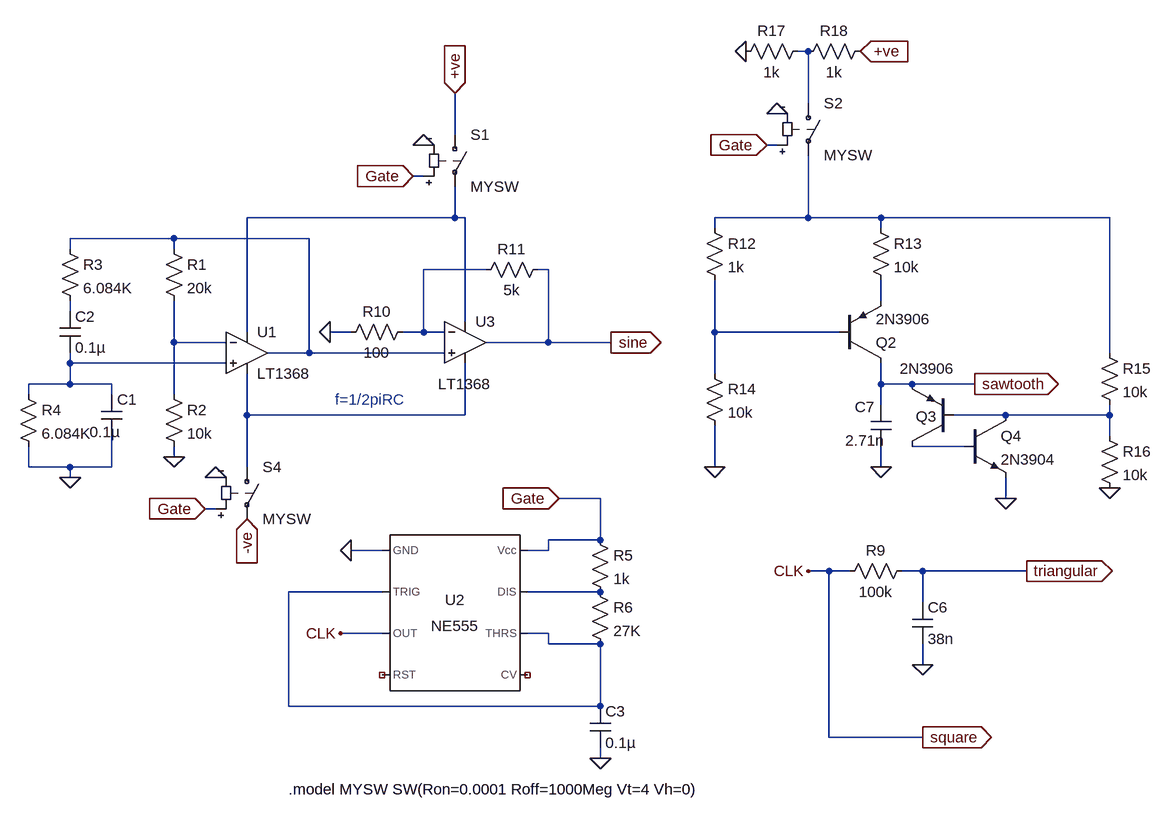
[diagram p0: schematic do.asc]
do.asc, the LTspice schematic file:
Version 4
SHEET 1 2324 792
WIRE -1168 -1440 -1184 -1440
WIRE -1168 -1360 -1168 -1440
WIRE -1712 -1312 -1712 -1376
WIRE -1216 -1296 -1232 -1296
WIRE -1760 -1248 -1776 -1248
WIRE -1712 -1184 -1712 -1232
WIRE -1712 -1184 -2032 -1184
WIRE -1696 -1184 -1712 -1184
WIRE -1168 -1184 -1168 -1280
WIRE -1168 -1184 -1312 -1184
WIRE -1056 -1184 -1168 -1184
WIRE -704 -1184 -1056 -1184
WIRE -1312 -1168 -1312 -1184
WIRE -1056 -1168 -1056 -1184
WIRE -2144 -1152 -2304 -1152
WIRE -1936 -1152 -2144 -1152
WIRE -2304 -1136 -2304 -1152
WIRE -2144 -1136 -2144 -1152
WIRE -1664 -1104 -1760 -1104
WIRE -1568 -1104 -1584 -1104
WIRE -1056 -1056 -1056 -1088
WIRE -2304 -1040 -2304 -1056
WIRE -1696 -1024 -1696 -1184
WIRE -2032 -1008 -2032 -1184
WIRE -1872 -1008 -1904 -1008
WIRE -1760 -1008 -1760 -1104
WIRE -1760 -1008 -1792 -1008
WIRE -1728 -1008 -1760 -1008
WIRE -1312 -1008 -1312 -1088
WIRE -1120 -1008 -1312 -1008
WIRE -2144 -992 -2144 -1056
WIRE -2064 -992 -2144 -992
WIRE -1568 -992 -1568 -1104
WIRE -1568 -992 -1664 -992
WIRE -1472 -992 -1568 -992
WIRE -1936 -976 -1936 -1152
WIRE -1936 -976 -2000 -976
WIRE -1728 -976 -1936 -976
WIRE -704 -976 -704 -1184
WIRE -2304 -960 -2304 -976
WIRE -2064 -960 -2304 -960
WIRE -1312 -944 -1312 -1008
WIRE -2304 -928 -2304 -960
WIRE -2304 -928 -2368 -928
WIRE -2240 -928 -2304 -928
WIRE -1056 -928 -1056 -960
WIRE -1008 -928 -1056 -928
WIRE -912 -928 -1008 -928
WIRE -2368 -912 -2368 -928
WIRE -2240 -912 -2240 -928
WIRE -2144 -912 -2144 -992
WIRE -1056 -896 -1056 -928
WIRE -2032 -880 -2032 -944
WIRE -1696 -880 -1696 -960
WIRE -1696 -880 -2032 -880
WIRE -864 -880 -944 -880
WIRE -704 -880 -704 -896
WIRE -704 -880 -864 -880
WIRE -704 -848 -704 -880
WIRE -928 -832 -1008 -832
WIRE -2144 -816 -2144 -832
WIRE -2368 -800 -2368 -832
WIRE -2304 -800 -2368 -800
WIRE -2240 -800 -2240 -848
WIRE -2240 -800 -2304 -800
WIRE -2032 -800 -2032 -880
WIRE -1312 -800 -1312 -864
WIRE -1056 -800 -1056 -832
WIRE -2304 -784 -2304 -800
WIRE -1488 -752 -1552 -752
WIRE -864 -752 -864 -784
WIRE -2080 -736 -2096 -736
WIRE -1488 -688 -1488 -752
WIRE -1488 -688 -1568 -688
WIRE -1824 -672 -1872 -672
WIRE -1568 -672 -1568 -688
WIRE -1568 -672 -1600 -672
WIRE -1136 -640 -1168 -640
WIRE -1104 -640 -1136 -640
WIRE -992 -640 -1024 -640
WIRE -832 -640 -992 -640
WIRE -1824 -608 -1968 -608
WIRE -1488 -608 -1600 -608
WIRE -992 -592 -992 -640
WIRE -1824 -544 -1888 -544
WIRE -1568 -544 -1600 -544
WIRE -1568 -528 -1568 -544
WIRE -1488 -528 -1568 -528
WIRE -992 -496 -992 -528
WIRE -1968 -432 -1968 -608
WIRE -1488 -432 -1488 -528
WIRE -1488 -432 -1968 -432
WIRE -1136 -384 -1136 -640
WIRE -992 -384 -1136 -384
WIRE -1488 -352 -1488 -368
FLAG -2144 -816 0
FLAG -2032 -720 -ve
IOPIN -2032 -720 In
FLAG -1472 -992 sine
IOPIN -1472 -992 Out
FLAG -1888 -544 CLK
FLAG -1872 -672 0
FLAG -1168 -640 CLK
FLAG -992 -496 0
FLAG -992 -384 square
IOPIN -992 -384 Out
FLAG -832 -640 triangular
IOPIN -832 -640 Out
FLAG -1904 -1008 0
FLAG -1712 -1376 +ve
IOPIN -1712 -1376 In
FLAG -2304 -784 0
FLAG -1488 -352 0
FLAG -1056 -800 0
FLAG -1312 -800 0
FLAG -864 -752 0
FLAG -704 -768 0
FLAG -1088 -1440 +ve
IOPIN -1088 -1440 In
FLAG -1264 -1440 0
FLAG -912 -928 sawtooth
IOPIN -912 -928 Out
FLAG -1216 -1344 0
FLAG -1232 -1296 Gate
IOPIN -1232 -1296 In
FLAG -1552 -752 Gate
IOPIN -1552 -752 In
FLAG -1760 -1296 0
FLAG -1776 -1248 Gate
IOPIN -1776 -1248 In
FLAG -2080 -784 0
FLAG -2096 -736 Gate
IOPIN -2096 -736 In
SYMBOL res -2160 -1152 R0
SYMATTR InstName R1
SYMATTR Value 20k
SYMBOL res -2160 -928 R0
SYMATTR InstName R2
SYMATTR Value 10k
SYMBOL Opamps\\LT1368 -2032 -1040 R0
SYMATTR InstName U1
SYMBOL Misc\\NE555 -1712 -576 R0
SYMATTR InstName U2
SYMBOL res -1008 -656 R90
WINDOW 0 0 56 VBottom 2
WINDOW 3 32 56 VTop 2
SYMATTR InstName R9
SYMATTR Value 100k
SYMBOL cap -1008 -592 R0
SYMATTR InstName C6
SYMATTR Value 38n
SYMBOL Opamps\\LT1368 -1696 -1056 R0
WINDOW 3 -42 128 Left 2
SYMATTR InstName U3
SYMBOL res -1776 -1024 R90
WINDOW 0 0 56 VBottom 2
WINDOW 3 32 56 VTop 2
SYMATTR InstName R10
SYMATTR Value 100
SYMBOL res -1568 -1120 R90
WINDOW 0 0 56 VBottom 2
WINDOW 3 32 56 VTop 2
SYMATTR InstName R11
SYMATTR Value 5k
SYMBOL cap -2256 -912 R0
WINDOW 3 -18 58 Left 2
SYMATTR Value 0.1µ
SYMATTR InstName C1
SYMBOL cap -2320 -1040 R0
SYMATTR InstName C2
SYMATTR Value 0.1µ
SYMBOL res -2320 -1152 R0
SYMATTR InstName R3
SYMATTR Value 6.084K
SYMBOL res -2384 -928 R0
SYMATTR InstName R4
SYMATTR Value 6.084K
SYMBOL res -1504 -704 R0
SYMATTR InstName R5
SYMATTR Value 1k
SYMBOL res -1504 -624 R0
SYMATTR InstName R6
SYMATTR Value 27K
SYMBOL cap -1504 -432 R0
SYMATTR InstName C3
SYMATTR Value 0.1µ
SYMBOL res -1328 -1184 R0
SYMATTR InstName R12
SYMATTR Value 1k
SYMBOL res -1072 -1184 R0
SYMATTR InstName R13
SYMATTR Value 10k
SYMBOL pnp -1120 -960 M180
SYMATTR InstName Q2
SYMATTR Value 2N3906
SYMBOL res -1328 -960 R0
SYMATTR InstName R14
SYMATTR Value 10k
SYMBOL pnp -944 -832 R180
WINDOW 0 26 46 Left 2
WINDOW 3 -2 120 Left 2
SYMATTR InstName Q3
SYMATTR Value 2N3906
SYMBOL cap -1072 -896 R0
WINDOW 0 -24 3 Left 2
WINDOW 3 -39 55 Left 2
SYMATTR InstName C7
SYMATTR Value 2.71n
SYMBOL npn -928 -880 R0
SYMATTR InstName Q4
SYMATTR Value 2N3904
SYMBOL res -720 -992 R0
SYMATTR InstName R15
SYMATTR Value 10k
SYMBOL res -720 -864 R0
SYMATTR InstName R16
SYMATTR Value 10k
SYMBOL res -1168 -1456 R90
WINDOW 0 0 56 VBottom 2
WINDOW 3 32 56 VTop 2
SYMATTR InstName R17
SYMATTR Value 1k
SYMBOL res -1072 -1456 R90
WINDOW 0 0 56 VBottom 2
WINDOW 3 32 56 VTop 2
SYMATTR InstName R18
SYMATTR Value 1k
SYMBOL sw -1168 -1376 R0
SYMATTR InstName S2
SYMATTR Value MYSW
SYMBOL sw -1712 -1328 R0
SYMATTR InstName S1
SYMATTR Value MYSW
SYMBOL sw -2032 -816 R0
SYMATTR InstName S4
SYMATTR Value MYSW
TEXT -1896 -904 Left 2 ;f=1/2piRC
TEXT -1968 -304 Left 2 !.model MYSW SW(Ron=0.0001 Roff=1000Meg Vt=4 Vh=0)

The netlist it stands for:
* do.asc
R1 N004 N009 20k
R2 N009 0 10k
XU1 N010 N009 N002 N011 N004 LT1368  ; pins In+ In- V+ V- OUT
XU2 0 N014 square NC_01 NC_02 N014 N015 Gate NE555  ; pins GND TRIG OUT RST CV THRS DIS Vcc
R9 triangular square 100k
C6 triangular 0 38n
XU3 N004 N005 N002 N011 sine LT1368  ; pins In+ In- V+ V- OUT
R10 N005 0 100
R11 sine N005 5k
C1 N010 0 0.1µ
C2 N007 N010 0.1µ
R3 N004 N007 6.084K
R4 N010 0 6.084K
R5 Gate N015 1k
R6 N015 N014 27K
C3 N014 0 0.1µ
R12 N003 N008 1k
R13 N003 N006 10k
Q2 sawtooth N008 N006 0 2N3906
R14 N008 0 10k
Q3 N013 N012 sawtooth 0 2N3906
C7 sawtooth 0 2.71n
Q4 N012 N013 0 0 2N3904
R15 N003 N012 10k
R16 N012 0 10k
R17 N001 0 1k
R18 +ve N001 1k
S2 N001 N003 Gate 0 MYSW
S1 +ve N002 Gate 0 MYSW
S4 N011 -ve Gate 0 MYSW
.model NPN NPN
.model PNP PNP
.lib standard.bjt
* f=1/2piRC
.model MYSW SW(Ron=0.0001 Roff=1000Meg Vt=4 Vh=0)
.lib NE555.sub
.backanno
.end